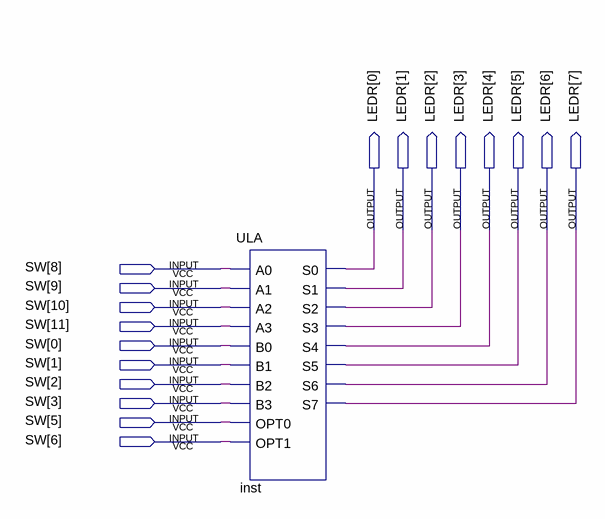
[diagram p0: schematic sheet]
// Quartus schematic Calculadora.bdf as structural Verilog: 1 symbols, 18 pins
module Calculadora (
  input  [11:0] SW,
  output [7:0] LEDR
);

  ULA inst (
    .A0(SW[8]), .A1(SW[9]), .A2(SW[10]), .A3(SW[11]), .B0(SW[0]), .B1(SW[1]), .B2(SW[2]), .B3(SW[3]),
    .OPT0(SW[5]), .OPT1(SW[6]), .S0(LEDR[0]), .S1(LEDR[1]), .S2(LEDR[2]), .S3(LEDR[3]), .S4(LEDR[4]),
    .S5(LEDR[5]), .S6(LEDR[6]), .S7(LEDR[7]));
endmodule
